# EAGLE design ssrv1 (EAGLE 5.06)

## Sheet 1 of 2
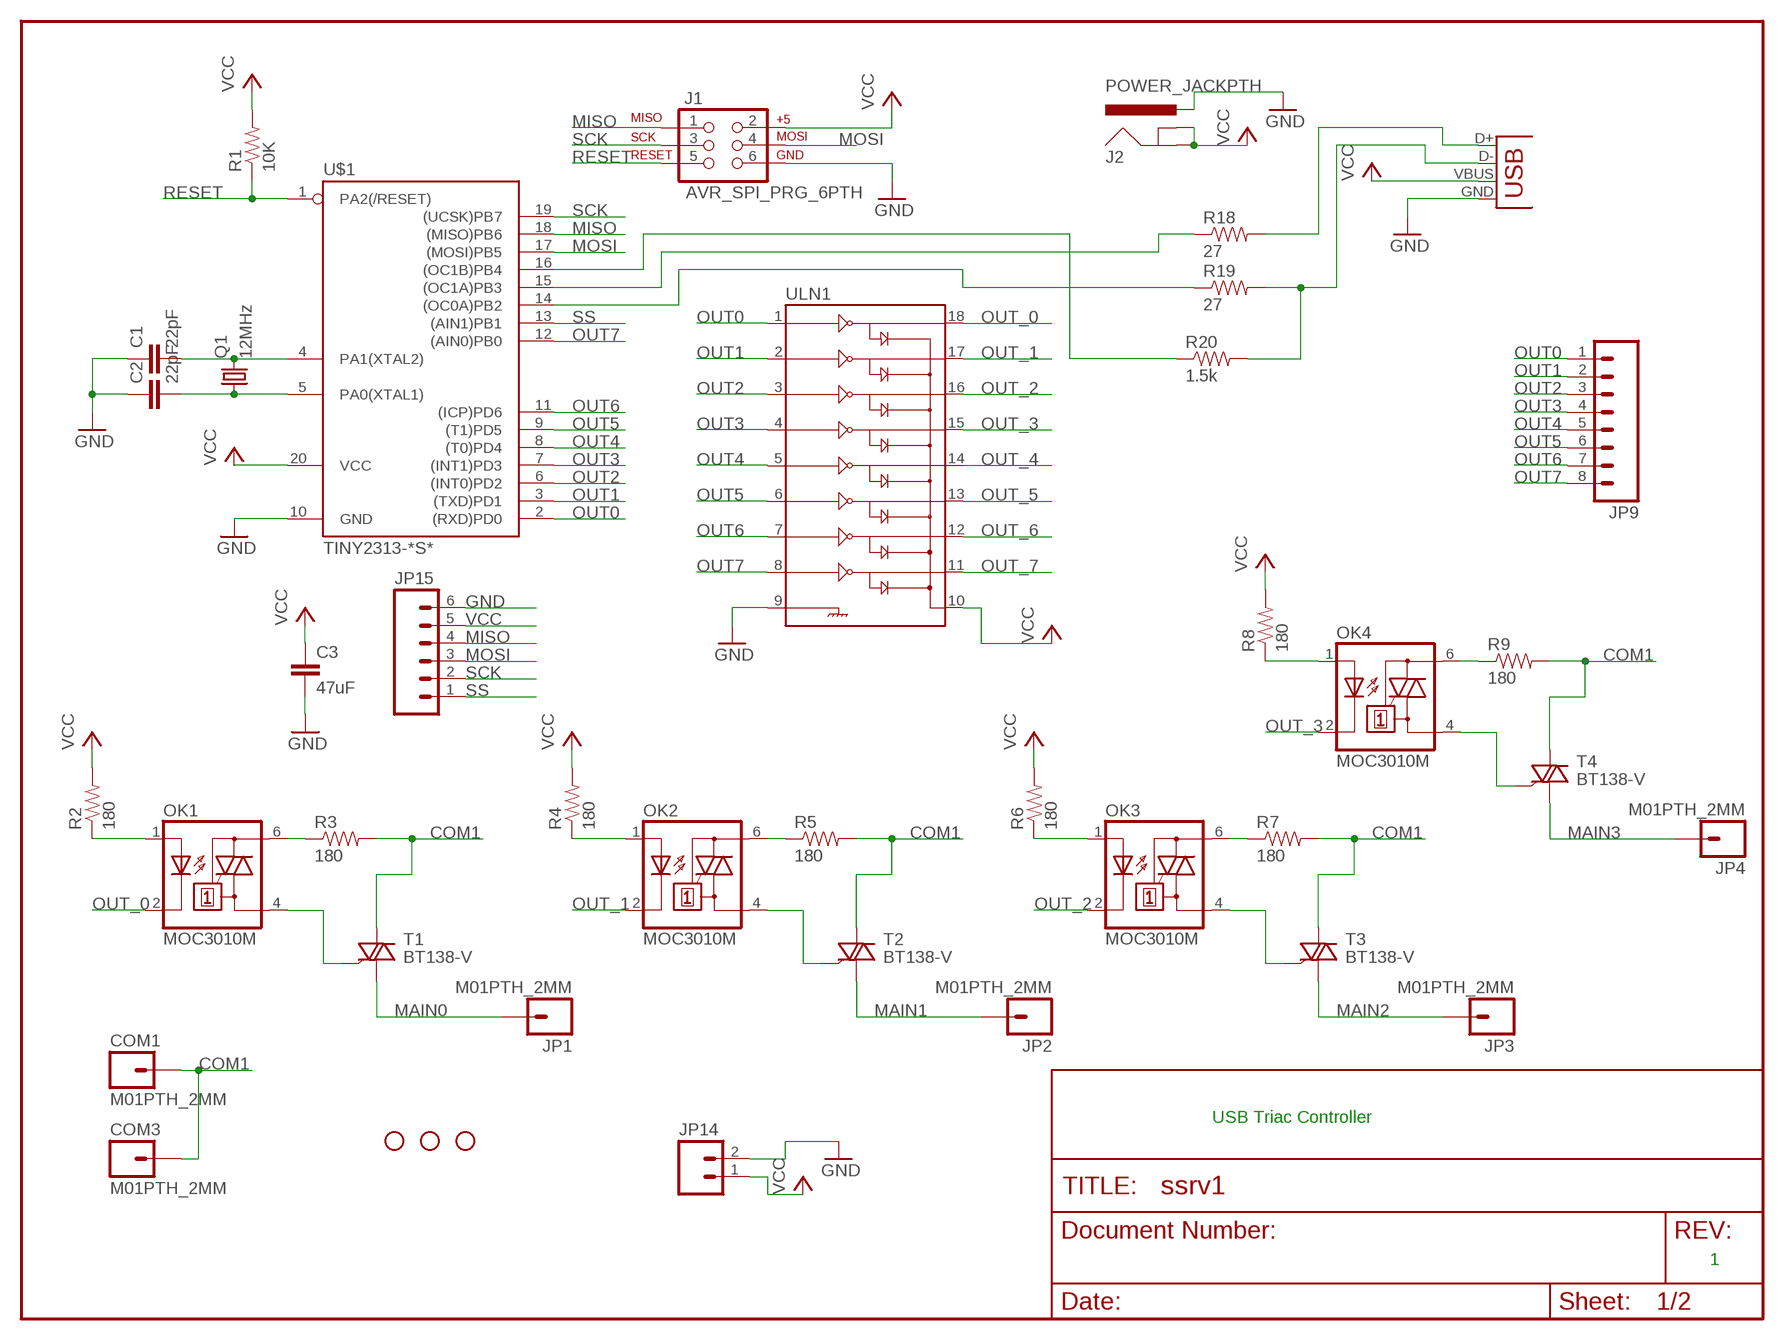
[diagram p0: schematic, sheet 1]

### Parts
C1  22pF  CAP0402-CAP  [0402-CAP]
C2  22pF  CAP0402-CAP  [0402-CAP]
C3  47uF  CAP1210  [1210]
COM1  M01PTH_2MM  [1X01_2MM]
COM3  M01PTH_2MM  [1X01_2MM]
J1  AVR_SPI_PRG_6PTH  [2X3]
J2  POWER_JACKPTH  [POWER_JACK_PTH]
JP1  M01PTH_2MM  [1X01_2MM]
JP2  M01PTH_2MM  [1X01_2MM]
JP3  M01PTH_2MM  [1X01_2MM]
JP4  M01PTH_2MM  [1X01_2MM]
JP9  M08  [1X08]
JP10  STAND-OFF  [STAND-OFF]
JP11  STAND-OFF  [STAND-OFF]
JP12  STAND-OFF  [STAND-OFF]
JP14  M02  [1X02_LONGPADS]
JP15  M06SIP  [1X06]
OK1  MOC3010M  [DIL06]
OK2  MOC3010M  [DIL06]
OK3  MOC3010M  [DIL06]
OK4  MOC3010M  [DIL06]
Q1  12MHz  CRYSTALTC38H  [TC38H]
R1  10K  RESISTOR0402-RES  [0402-RES]
R2  180  RESISTOR0402-RES  [0402-RES]
R3  180  RESISTORPTH1  [AXIAL-0.3]
R4  180  RESISTOR0402-RES  [0402-RES]
R5  180  RESISTORPTH1  [AXIAL-0.3]
R6  180  RESISTOR0402-RES  [0402-RES]
R7  180  RESISTORPTH1  [AXIAL-0.3]
R8  180  RESISTOR0402-RES  [0402-RES]
R9  180  RESISTORPTH1  [AXIAL-0.3]
R18  27  RESISTOR0402-RES  [0402-RES]
R19  27  RESISTOR0402-RES  [0402-RES]
R20  1.5k  RESISTOR0402-RES  [0402-RES]
T1  BT138-V  [TO220BV]
T2  BT138-V  [TO220BV]
T3  BT138-V  [TO220BV]
T4  BT138-V  [TO220BV]
U$1  TINY2313-*S*  [SO20L$]
ULN1  ULN2803SOICW  [SO18L]
X1  USBSMD  [USB-MINIB]

### Nets
COM1 [AC]: COM1.1 COM3.1 R3.P$2 R5.P$2 R7.P$2 R9.P$2 T1.T2(A2) T2.T2(A2) T3.T2(A2) T4.T2(A2)
GND: C1.1 C2.1 C3.2 J1.6 J2.PWR JP14.2 JP15.6 U$1.10(GND) ULN1.9 X1.GND
MAIN0 [AC]: JP1.1 T1.T1(A1)
MAIN1 [AC]: JP2.1 T2.T1(A1)
MAIN2 [AC]: JP3.1 T3.T1(A1)
MAIN3 [AC]: JP4.1 T4.T1(A1)
MISO: J1.1 JP15.4 U$1.18((MISO)PB6)
MOSI: J1.4 JP15.3 U$1.17((MOSI)PB5)
N$1: C2.2 Q1.1 U$1.5(PA0(XTAL1))
N$2: OK1.6(A2) R3.P$1
N$3: OK1.1(A) R2.1
N$4: C1.2 Q1.2 U$1.4(PA1(XTAL2))
N$5: OK2.4(A1) T2.G
N$6: OK1.4(A1) T1.G
N$7: OK2.6(A2) R5.P$1
N$8: OK2.1(A) R4.1
N$9: OK3.4(A1) T3.G
N$10: OK3.6(A2) R7.P$1
N$11: OK3.1(A) R6.1
N$12: OK4.4(A1) T4.G
N$13: OK4.6(A2) R9.P$1
N$14: OK4.1(A) R8.1
N$27: R19.2 R20.2 X1.D-
N$28: R19.1 U$1.14((OC0A)PB2)
N$29: R18.2 X1.D+
N$30: R18.1 U$1.15((OC1A)PB3)
N$31: R20.1 U$1.16((OC1B)PB4)
OUT0: JP9.1 U$1.2((RXD)PD0) ULN1.1
OUT1: JP9.2 U$1.3((TXD)PD1) ULN1.2
OUT2: JP9.3 U$1.6((INT0)PD2) ULN1.3
OUT3: JP9.4 U$1.7((INT1)PD3) ULN1.4
OUT4: JP9.5 U$1.8((T0)PD4) ULN1.5
OUT5: JP9.6 U$1.9((T1)PD5) ULN1.6
OUT6: JP9.7 U$1.11((ICP)PD6) ULN1.7
OUT7: JP9.8 U$1.12((AIN0)PB0) ULN1.8
OUT_0: OK1.2(C) ULN1.18
OUT_1: OK2.2(C) ULN1.17
OUT_2: OK3.2(C) ULN1.16
OUT_3: OK4.2(C) ULN1.15
OUT_4: ULN1.14 ; also sheet 2
OUT_5: ULN1.13 ; also sheet 2
OUT_6: ULN1.12 ; also sheet 2
OUT_7: ULN1.11 ; also sheet 2
RESET: J1.5 R1.1 U$1.1(PA2(/RESET))
SCK: J1.3 JP15.2 U$1.19((UCSK)PB7)
SS: JP15.1 U$1.13((AIN1)PB1)
VCC: C3.1 J1.2 J2.GND J2.GNDBREAK JP14.1 JP15.5 R1.2 R2.2 R4.2 R6.2 R8.2 U$1.20(VCC) ULN1.10 X1.VBUS ; also sheet 2

### Notes on the sheet
- USB Triac Controller
- 1

## Sheet 2 of 2
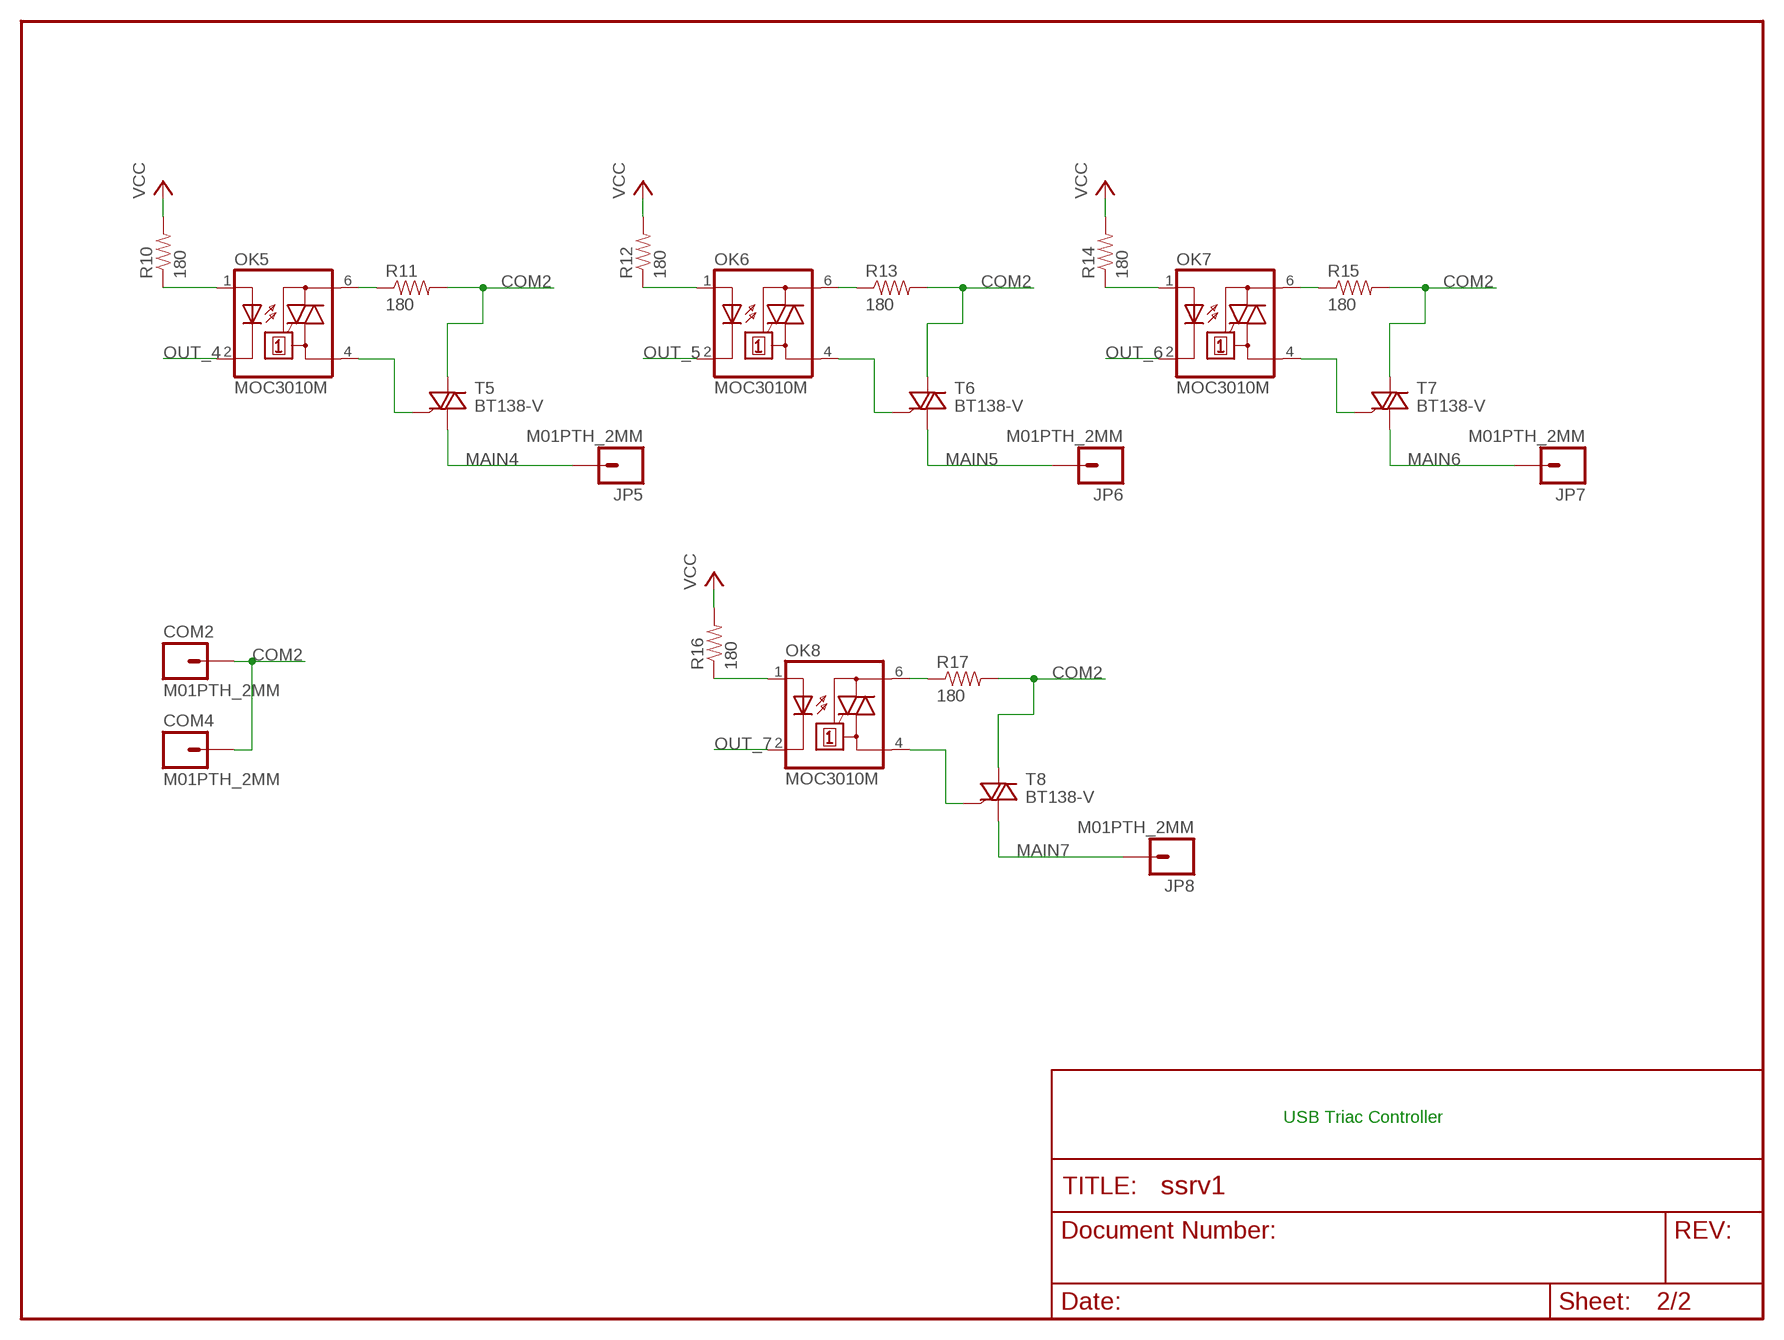
[diagram p1: schematic, sheet 2]

### Parts
COM2  M01PTH_2MM  [1X01_2MM]
COM4  M01PTH_2MM  [1X01_2MM]
JP5  M01PTH_2MM  [1X01_2MM]
JP6  M01PTH_2MM  [1X01_2MM]
JP7  M01PTH_2MM  [1X01_2MM]
JP8  M01PTH_2MM  [1X01_2MM]
OK5  MOC3010M  [DIL06]
OK6  MOC3010M  [DIL06]
OK7  MOC3010M  [DIL06]
OK8  MOC3010M  [DIL06]
R10  180  RESISTOR0402-RES  [0402-RES]
R11  180  RESISTORPTH1  [AXIAL-0.3]
R12  180  RESISTOR0402-RES  [0402-RES]
R13  180  RESISTORPTH1  [AXIAL-0.3]
R14  180  RESISTOR0402-RES  [0402-RES]
R15  180  RESISTORPTH1  [AXIAL-0.3]
R16  180  RESISTOR0402-RES  [0402-RES]
R17  180  RESISTORPTH1  [AXIAL-0.3]
T5  BT138-V  [TO220BV]
T6  BT138-V  [TO220BV]
T7  BT138-V  [TO220BV]
T8  BT138-V  [TO220BV]

### Nets
COM2 [AC]: COM2.1 COM4.1 R11.P$2 R13.P$2 R15.P$2 R17.P$2 T5.T2(A2) T6.T2(A2) T7.T2(A2) T8.T2(A2)
MAIN4 [AC]: JP5.1 T5.T1(A1)
MAIN5 [AC]: JP6.1 T6.T1(A1)
MAIN6 [AC]: JP7.1 T7.T1(A1)
MAIN7 [AC]: JP8.1 T8.T1(A1)
N$15: OK5.4(A1) T5.G
N$16: OK5.6(A2) R11.P$1
N$17: OK5.1(A) R10.1
N$18: OK6.4(A1) T6.G
N$19: OK6.6(A2) R13.P$1
N$20: OK6.1(A) R12.1
N$21: OK7.4(A1) T7.G
N$22: OK7.6(A2) R15.P$1
N$23: OK7.1(A) R14.1
N$24: OK8.4(A1) T8.G
N$25: OK8.6(A2) R17.P$1
N$26: OK8.1(A) R16.1
OUT_4: OK5.2(C) ; also sheet 1
OUT_5: OK6.2(C) ; also sheet 1
OUT_6: OK7.2(C) ; also sheet 1
OUT_7: OK8.2(C) ; also sheet 1
VCC: R10.2 R12.2 R14.2 R16.2 ; also sheet 1

### Notes on the sheet
- USB Triac Controller

## Library data of the parts
C1-C3 = SparkFun:CAP: Capacitor Standard 0603 ceramic capacitor, and 0.1" leaded capacitor.
COM1-COM4 JP1-JP8 = SparkFun:M01: Header 1 Standard 1-pin 0.1" header. Use with straight break away headers (SKU : PRT-00116), right angle break away headers (PRT-00553), swiss pins (PRT-00743), machine pins (PRT-00117), and female headers (PRT-00115).
J1 = SparkFun:AVR_SPI_PRG_6: AVR ISP 6 Pin This is the reduced ISP connector for AVR programming. Common on Arduino. This footprint will take up less PCB space and can be used with a 10-pin to 6-pin adapter such as SKU: BOB-08508
J2 = SparkFun:POWER_JACK: Power Jack This is the standard 5.5mm barrel jack for power. The PTH is the most common, proven, reliable, footprint. All others are experimental. The Slot footprint only works if the mill layer is transmitted to the PCB fab house so be warned. Spark Fun Electronics SKU : PRT-00119. Mating wall wart : TOL-00298 (and others)
JP9 = SparkFun:M08: Header 8 Standard 8-pin 0.1" header. Use with straight break away headers (SKU : PRT-00116), right angle break away headers (PRT-00553), swiss pins (PRT-00743), machine pins (PRT-00117), and female headers (PRT-00115).
JP10-JP12 = SparkFun:STAND-OFF: Stand Off This is the mechanical footprint for a #4 phillips button head screw. Use the keepout ring to avoid running the screw head into surrounding components. SKU : PRT-00447
JP14 = SparkFun:M02: Header 2 Standard 2-pin 0.1" header. Use with straight break away headers (SKU : PRT-00116), right angle break away headers (PRT-00553), swiss pins (PRT-00743), machine pins (PRT-00117), and female headers (PRT-00115). Molex polarized connector foot print use with SKU : PRT-08233 with associated crimp pins and housings.
JP15 = SparkFun:M06: Header 6 Standard 6-pin 0.1" header. Use with straight break away headers (SKU : PRT-00116), right angle break away headers (PRT-00553), swiss pins (PRT-00743), machine pins (PRT-00117), and female headers (PRT-00115). Molex polarized connector foot print use with SKU : PRT-08094 with associated crimp pins and housings. NOTES ON THE VARIANTS LOCK and LOCK_LONGPADS... This footprint was designed to help hold the alignment of a through-hole component (i.e. 6-pin header) while soldering it into place. You may notice that each hole has been shifted either up or down by 0.005 of an inch from it's more standard position (which is a perfectly straight line). This slight alteration caused the pins (the squares in the middle) to touch the edges of the holes. Because they are alternating, it causes a "brace" to hold the component in place. 0.005 has proven to be the perfect amount of "off-center" position when using our standard breakaway headers. Although looks a little odd when you look at the bare footprint, once you have a header in there, the alteration is very hard to notice. Also, if you push a header all the way into place, it is covered up entirely on the bottom side. This idea of altering the position of holes to aid alignment will be further integrated into the Sparkfun Library for other footprints. It can help hold any component with 3 or more connection pins.
OK1-OK8 = optocoupler:MOC30*M: RANDOM-PHASE OPTOISOLATORS TRIAC DRIVER OUTPUT Source: http://www.fairchildsemi.com MOC3020-M.pdf
Q1 = SparkFun:CRYSTAL: Crystals Various standard crystals. Proven footprints. Spark Fun Electronics SKU : COM-00534
R1-R20 = SparkFun:RESISTOR: Resistor Basic schematic elements and footprints for 0603, 1206, and PTH 1/10th watt (small) resistors.
T1-T8 = triac:BT138: TRIAC Source: http://www.semiconductors.philips.com BT138_SERIES_2.pdf
U$1 = avr-6:TINY2313*: Atmel Tiny2313 2K Flash, 128 bytes EEPROM, 128 bytes RAM
ULN1 = SparkFun:ULN2803: Darlington Driver ULN2803 Darlington array. 500mA max per channel, 8-channel package. Spark Fun Electronics SKU : COM-00312
X1 = SparkFun:USB: USB Connectors USB-B-PTH is fully proven SKU : PRT-00139 USB-miniB is fully proven SKU : PRT-00587 USB-A-PCB is untested. USB-A-H is throughly reviewed, but untested. Spark Fun Electronics SKU : PRT-00437 USB-B-SMT is throughly reviewed, but untested. Needs silkscreen touching up. USB-A-S has not been used/tested USB-MB-H has not been used/tested

## Net classes
1 AC: width 1.524 mm, clearance 1.016 mm

## Board
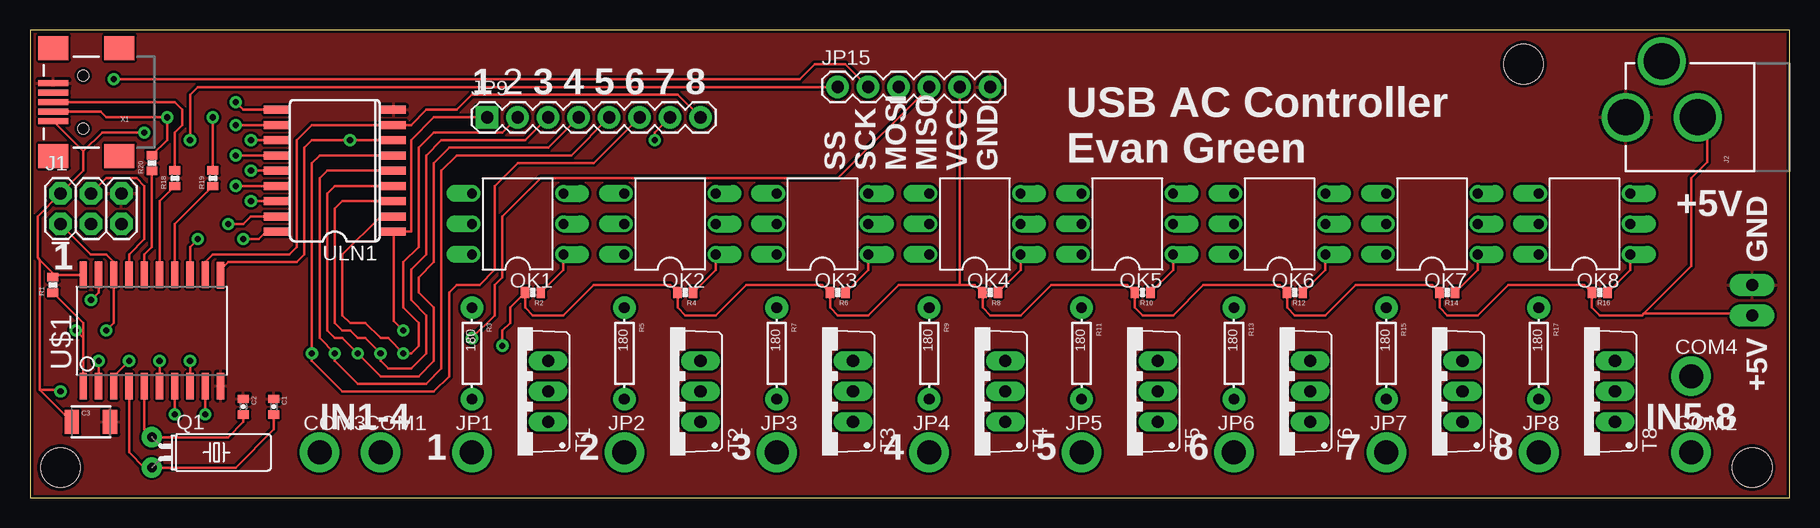
[diagram p2: board, top side]
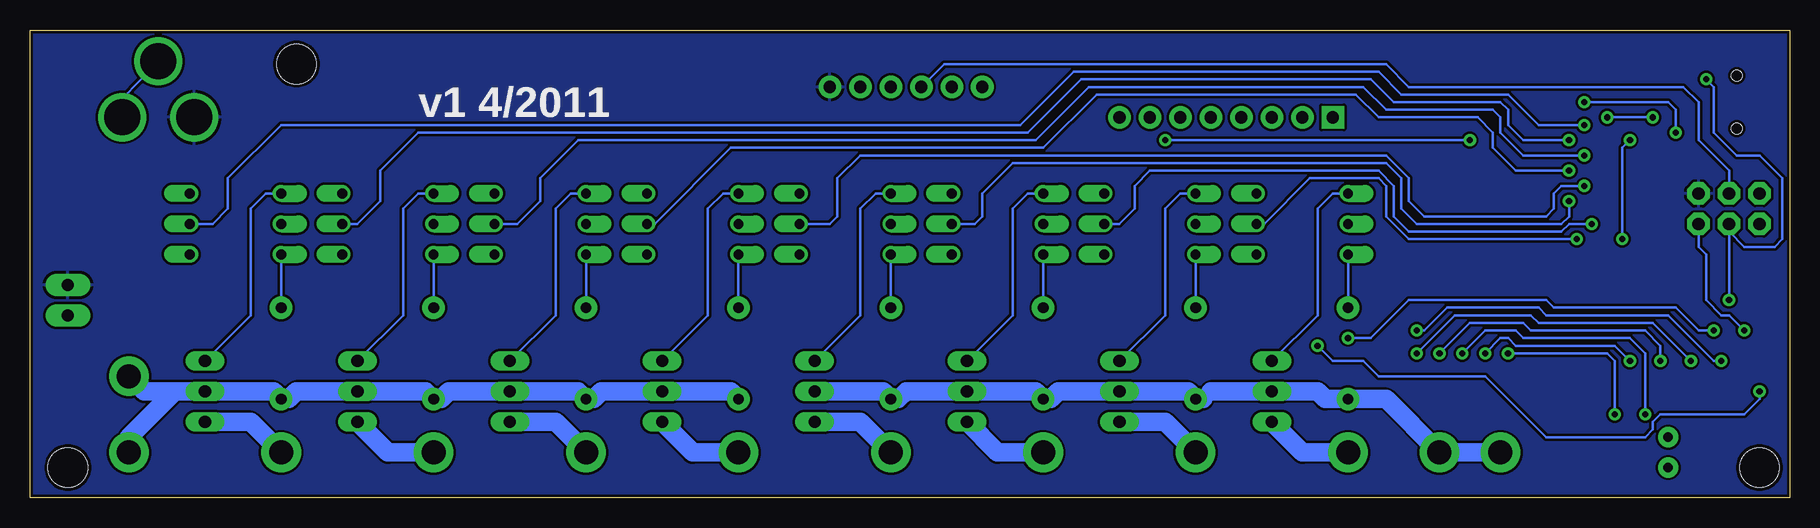
[diagram p3: board, bottom side, seen from below]

Size 146.66 x 39.04 mm. Coordinates in mm from the lower left corner, seen from the top.
Outline: 0,0 146.66,0 146.66,39.04 0,39.04 0,0
Copper layers (1*16): Top 0.035mm / dielectric 1.5mm / Bottom 0.035mm
Design rules "SparkFun": minimum track width 8mil, minimum drill 20mil, track to track 8mil, track to pad 8mil, pad to pad 8mil, via to via 8mil, smd to smd 8mil, copper to edge 10mil, drill to drill 8mil, minimum pad ring 12mil, minimum via ring 10mil, stop-mask expansion 4mil, vias tented up to drill 25mil, thermal gap 10mil

### Footprints (pad centres in the part's own frame; a part is rotated, then mirrored left to right if it is on the bottom)
0402-CAP = smd 0.7 x 0.9: 1 -0.65,0; 2 0.65,0
1210 = smd 1.2 x 2: 1 -1.6,0; 2 1.6,0
1X01_2MM = drill 2 pad 3.302 round: 1 0,0
2X3 = drill 1.016 pad 1.88 octagon: 1 0,0; 2 0,2.54; 3 2.54,0; 4 2.54,2.54; 5 5.08,0; 6 5.08,2.54
POWER_JACK_PTH = drill 2.997 round: GND 0,7.7; GNDBREAK 4.7,10.7; PWR 0,13.7
1X08 = drill 1.016 pad 1.88 square: 1 0,0 | drill 1.016 pad 1.88 round: 2 2.54,0; 3 5.08,0; 4 7.62,0; 5 10.16,0; 6 12.7,0; 7 15.24,0; 8 17.78,0
STAND-OFF = hole 3.302: 0,0
1X02_LONGPADS = drill 1.016 pad 1.88 long: 1 0,0; 2 2.54,0
1X06 = drill 1.016 pad 1.88 round: 1 0,0; 2 2.54,0; 3 5.08,0; 4 7.62,0; 5 10.16,0; 6 12.7,0
DIL06 = drill 0.813 offset: 1 -2.54,-3.81; 2 0,-3.81; 3 2.54,-3.81; 4 2.54,3.81; 5 0,3.81; 6 -2.54,3.81
TC38H = drill 0.813 pad 1.676 round: 1 -1.27,0; 2 1.27,0
0402-RES = smd 0.7 x 0.9: 1 -0.65,0; 2 0.65,0
AXIAL-0.3 = drill 0.9 pad 1.88 round: P$1 -3.81,0; P$2 3.81,0
TO220BV = drill 1.016 long: G 2.54,-2.54; T1 -2.54,-2.54; T2 0,-2.54
SO20L$ = smd 0.61 x 2.21: 1 -5.715,-4.636; 2 -4.445,-4.636; 3 -3.175,-4.636; 4 -1.905,-4.636; 5 -0.635,-4.636; 6 0.635,-4.636; 7 1.905,-4.636; 8 3.175,-4.636; 9 4.445,-4.636; 10 5.715,-4.636; 11 5.715,4.61; 12 4.445,4.636; 13 3.175,4.636; 14 1.905,4.636; 15 0.635,4.636; 16 -0.635,4.636; 17 -1.905,4.636; 18 -3.175,4.636; 19 -4.445,4.636; 20 -5.715,4.636
SO18L = smd 0.66 x 2.032: 1 -0.635,-4.902; 2 0.635,-4.902; 3 1.905,-4.902; 4 3.175,-4.902; 5 4.445,-4.902; 6 5.715,-4.902; 7 6.985,-4.902; 8 8.255,-4.902; 9 9.525,-4.902; 10 9.525,4.902; 11 8.255,4.902; 12 6.985,4.902; 13 5.715,4.902; 14 4.445,4.902; 15 3.175,4.902; 16 1.905,4.902; 17 0.635,4.902; 18 -0.635,4.902
USB-MINIB = smd 2.5 x 0.5: D+ 2.5,0; D- 2.5,0.8; GND 2.5,-1.6; ID 2.5,-0.8; VBUS 2.5,1.6 | smd 2.5 x 2: GND@1 -3,-4.5; GND@2 -3,4.5; GND@3 2.5,4.5; GND@4 2.5,-4.5 | hole 0.9: 0,2.2; 0,-2.2

### Placement (x,y rotation side)
C1  20.32,7.62 270 top
C2  17.78,7.62 270 top
C3  5.08,6.35 0 top
COM1  29.21,3.81 0 top
COM2  138.43,3.81 0 top
COM3  24.13,3.81 0 top
COM4  138.43,10.16 0 top
J1  2.54,22.86 0 top
J2  146.69,31.75 90 top
JP1  36.83,3.81 0 top
JP2  49.53,3.81 0 top
JP3  62.23,3.81 0 top
JP4  74.93,3.81 0 top
JP5  87.63,3.81 0 top
JP6  100.33,3.81 0 top
JP7  113.03,3.81 0 top
JP8  125.73,3.81 0 top
JP9  38.1,31.75 0 top
JP10  2.54,2.54 0 top
JP11  143.51,2.54 0 top
JP12  124.46,36.2 0 top
JP14  143.51,15.24 90 top
JP15  67.31,34.29 0 top
OK1  40.64,22.86 90 top
OK2  53.34,22.86 90 top
OK3  66.04,22.86 90 top
OK4  78.74,22.86 90 top
OK5  91.44,22.86 90 top
OK6  104.14,22.86 90 top
OK7  116.84,22.86 90 top
OK8  129.54,22.86 90 top
Q1  10.16,3.81 270 top
R1  1.91,17.78 90 top
R2  41.91,17.14 180 top
R3  36.83,12.06 270 top
R4  54.61,17.14 180 top
R5  49.53,12.06 270 top
R6  67.31,17.14 180 top
R7  62.23,12.06 270 top
R8  80.01,17.14 180 top
R9  74.93,12.06 270 top
R10  92.71,17.14 180 top
R11  87.63,12.06 270 top
R12  105.41,17.14 180 top
R13  100.33,12.06 270 top
R14  118.11,17.14 180 top
R15  113.03,12.06 270 top
R16  130.81,17.14 180 top
R17  125.73,12.06 270 top
R18  12.06,26.67 90 top
R19  15.24,26.67 90 top
R20  10.16,27.94 90 top
T1  40.64,8.89 90 top
T2  53.34,8.89 90 top
T3  66.04,8.89 90 top
T4  78.74,8.89 90 top
T5  91.44,8.89 90 top
T6  104.14,8.89 90 top
T7  116.84,8.89 90 top
T8  129.54,8.89 90 top
U$1  10.16,13.97 0 top
ULN1  25.4,22.86 90 top
X1  4.45,33.02 180 top

### Tracks (layer width: path | path; a pad name or v marks a point on that pad's centre or on a via)
COM1
  Bottom 1.016: 48.26,8.89 48.9,8.26 | 61.59,8.26 R7.P$2
  Bottom 1.524: 48.26,8.89 T1.T2 39.37,8.89 38.73,8.26 R3.P$2 33.66,8.26 COM1.1 COM3.1 | 48.9,8.26 R5.P$2 50.16,8.89 T2.T2 60.96,8.89 61.59,8.26 | R7.P$2 62.87,8.89 T3.T2 73.66,8.89 74.3,8.26 R9.P$2 75.56,8.89 T4.T2
COM2
  Bottom 1.016: 88.27,8.89 T5.T2 | 125.09,8.26 R17.P$2
  Bottom 1.524: R11.P$2 88.27,8.89 99.06,8.89 99.69,8.26 R13.P$2 100.97,8.89 T6.T2 111.76,8.89 112.39,8.26 R15.P$2 113.67,8.89 T7.T2 124.46,8.89 125.09,8.26 | R17.P$2 126.36,8.89 T8.T2 134.62,8.89 | 134.62,8.89 138.43,5.08 COM2.1 | COM4.1 137.16,8.89 134.62,8.89
GND
  pour Top: 0,0 146.69,0 146.69,38.73 0,38.73
  pour Bottom: 0,0 146.69,0 146.69,38.73 0,38.73
MAIN0
  Bottom 1.524: T1.T1 40.64,3.81 JP1.1
MAIN1
  Bottom 1.524: JP2.1 52.07,6.35 T2.T1
MAIN2
  Bottom 1.524: T3.T1 66.04,3.81 JP3.1
MAIN3
  Bottom 1.524: JP4.1 77.47,6.35 T4.T1
MAIN4
  Bottom 1.524: JP5.1 91.44,3.81 T5.T1
MAIN5
  Bottom 1.524: JP6.1 102.87,6.35 T6.T1
MAIN6
  Bottom 1.524: JP7.1 116.84,3.81 T7.T1
MAIN7
  Bottom 1.524: JP8.1 128.27,6.35 T8.T1
MISO  (via drill 0.51)
  Top 0.203: J1.1 5.08,20.32 6.35,20.32 6.99,19.68 U$1.18 6.99,14.61 v6.35,13.97 | JP15.4 67.31,26.67 42.55,26.67 39.37,23.5 39.37,18.41 38.73,17.78 38.73,15.24 v36.83,13.34
  Bottom 0.203: v6.35,13.97 7.62,13.97 9.53,15.88 19.68,15.88 20.32,16.51 31.75,16.51 34.92,13.34 v36.83,13.34
MOSI
  Top 0.203: J1.4 6.35,26.67 8.89,26.67 9.53,26.04 9.53,21.59 8.26,20.32 U$1.17
  Bottom 0.203: JP15.3 70.48,36.2 33.66,36.2 31.75,34.29 8.89,34.29 7.62,33.02 7.62,29.84 5.08,27.3 J1.4
N$1
  Top 0.203: U$1.5 9.53,5.71 Q1.1 16.51,5.08 17.78,6.35 C2.2
N$2
  Bottom 0.203: R3.P$1 OK1.6
N$3
  Top 0.203: R2.1 44.45,19.04 OK1.1
N$4
  Top 0.203: U$1.4 8.26,3.81 9.53,2.54 Q1.2 17.14,2.54 20.32,5.71 C1.2
N$5
  Bottom 0.203: T2.G 52.07,15.24 52.07,24.13 50.8,25.4 OK2.4
N$6
  Bottom 0.203: T1.G 39.37,15.24 39.37,24.13 38.1,25.4 OK1.4
N$7
  Bottom 0.203: R5.P$1 OK2.6
N$8
  Top 0.203: R4.1 57.15,19.04 OK2.1
N$9
  Bottom 0.203: T3.G 64.77,15.24 64.77,24.13 63.5,25.4 OK3.4
N$10
  Bottom 0.203: R7.P$1 OK3.6
N$11
  Top 0.203: R6.1 69.85,19.04 OK3.1
N$12
  Bottom 0.203: T4.G 77.47,15.24 77.47,24.13 76.2,25.4 OK4.4
N$13
  Bottom 0.203: R9.P$1 OK4.6
N$14
  Top 0.203: R8.1 82.55,19.04 OK4.1
N$15
  Bottom 0.203: T5.G 90.17,15.24 90.17,24.13 88.9,25.4 OK5.4
N$16
  Bottom 0.203: R11.P$1 OK5.6
N$17
  Top 0.203: R10.1 95.25,19.04 OK5.1
N$18
  Bottom 0.203: T6.G 102.87,15.24 102.87,24.13 101.6,25.4 OK6.4
N$19
  Bottom 0.203: R13.P$1 OK6.6
N$20
  Top 0.203: R12.1 107.95,19.04 OK6.1
N$21
  Bottom 0.203: T7.G 115.57,15.24 115.57,24.13 114.3,25.4 OK7.4
N$22
  Bottom 0.203: R15.P$1 OK7.6
N$23
  Top 0.203: R14.1 120.65,19.04 OK7.1
N$24
  Bottom 0.203: T8.G 128.27,15.24 128.27,24.13 127,25.4 OK8.4
N$25
  Bottom 0.203: R17.P$1 OK8.6
N$26
  Top 0.203: R16.1 133.35,19.04 OK8.1
N$27  (via drill 0.51)
  Top 0.203: v15.24,31.75 R19.2 | X1.D- 5.88,32.22 6.35,31.75 v11.43,31.75 11.43,29.86 R20.2
  Bottom 0.203: v11.43,31.75 v15.24,31.75
N$28
  Top 0.203: U$1.14 12.06,22.86 15.22,26.02 R19.1
N$29
  Top 0.203: X1.D+ 12.06,33.02 12.7,32.38 12.7,31.11 12.06,30.48 R18.2
N$30
  Top 0.203: U$1.15 10.79,24.77 R18.1
N$31
  Top 0.203: U$1.16 9.53,20.32 10.16,20.95 R20.1
OUT0  (via drill 0.51)
  Top 0.203: U$1.2 v5.71,11.43 | v31.11,13.97 30.3,14.78 ULN1.1 31.75,22.23 31.75,29.84 33.66,31.75 JP9.1
  Bottom 0.203: v5.71,11.43 6.35,11.43 10.16,15.24 20.32,15.24 20.95,15.88 28.57,15.88 30.48,13.97 v31.11,13.97
OUT1  (via drill 0.51)
  Top 0.203: ULN1.2 29.21,23.5 26.04,20.32 26.04,15.24 26.67,14.61 27.94,14.61 29.21,13.34 29.84,13.34 v31.11,12.06 31.75,12.06 32.38,12.7 32.38,14.61 31.11,15.88 31.11,19.68 32.38,20.95 32.38,29.21 33.66,30.48 39.37,30.48 JP9.2 | v8.26,11.43 6.99,10.16 U$1.3
  Bottom 0.203: v31.11,12.06 27.94,15.24 21.59,15.24 20.95,14.61 11.43,14.61 v8.26,11.43
OUT2  (via drill 0.51)
  Top 0.203: ULN1.3 26.04,24.77 25.4,24.13 25.4,14.61 26.04,13.97 26.67,13.97 27.3,13.34 27.94,13.34 v29.21,12.06 29.21,11.43 29.84,10.79 31.75,10.79 33.02,12.06 33.02,15.24 31.75,16.51 31.75,19.05 33.02,20.32 33.02,28.57 34.29,29.84 41.27,29.84 JP9.3 | U$1.6 v10.79,11.43
  Bottom 0.203: v29.21,12.06 26.67,14.61 22.23,14.61 21.59,13.97 12.06,13.97 10.79,12.7 v10.79,11.43
OUT3  (via drill 0.51)
  Top 0.203: ULN1.4 25.4,26.04 24.77,25.4 24.77,13.97 25.4,13.34 26.04,13.34 v27.3,12.06 29.21,10.16 32.38,10.16 33.66,11.43 33.66,15.88 32.38,17.14 32.38,18.41 33.66,19.68 33.66,27.94 34.92,29.21 43.18,29.21 JP9.4 | v12.06,6.99 U$1.7
  Bottom 0.203: v27.3,12.06 25.4,13.97 22.86,13.97 22.23,13.34 13.34,13.34 12.06,12.06 v12.06,6.99
OUT4  (via drill 0.51)
  Top 0.203: U$1.8 v13.34,11.43 | ULN1.5 24.77,27.3 24.13,26.67 24.13,13.34 v25.4,12.06 25.4,11.43 27.3,9.53 33.02,9.53 34.29,10.79 34.29,27.3 35.56,28.57 45.09,28.57 JP9.5
  Bottom 0.203: v25.4,12.06 24.13,13.34 23.5,13.34 22.86,12.7 14.61,12.7 v13.34,11.43
OUT5  (via drill 0.51)
  Top 0.203: ULN1.6 24.13,28.57 23.5,27.94 v23.5,12.06 23.5,11.43 26.04,8.89 33.66,8.89 34.92,10.16 34.92,17.14 35.56,17.78 37.47,17.78 38.73,19.05 38.73,26.04 40.64,27.94 46.99,27.94 JP9.6 | v14.61,6.99 U$1.9
  Bottom 0.203: v23.5,12.06 15.24,12.06 14.61,11.43 v14.61,6.99
OUT6  (via drill 0.51)
  Top 0.203: ULN1.7 27.94,29.84 v26.67,29.84 23.5,29.84 22.86,29.21 22.86,20.32 22.23,19.68 16.51,19.68 15.88,19.05 U$1.11 | JP9.7 52.07,30.48 v52.07,29.84
  Bottom 0.203: v26.67,29.84 v52.07,29.84
OUT7
  Top 0.203: U$1.12 14.61,19.68 15.24,20.32 21.59,20.32 22.23,20.95 22.23,29.84 23.5,31.11 ULN1.8 31.75,31.11 33.02,32.38 35.56,32.38 36.83,33.66 53.98,33.66 JP9.8
OUT_0  (via drill 0.51)
  Top 0.203: ULN1.18 19.68,22.23 19.05,21.59 v17.78,21.59
  Bottom 0.203: v17.78,21.59 31.75,21.59 33.66,23.5 33.66,26.04 34.29,26.67 40.01,26.67 43.81,22.86 OK1.2
OUT_1  (via drill 0.51)
  Top 0.203: ULN1.17 18.41,23.5 17.78,22.86 v16.51,22.86
  Bottom 0.203: v16.51,22.86 18.41,22.86 19.05,22.23 31.75,22.23 33.02,23.5 33.02,26.04 34.29,27.3 53.34,27.3 54.61,26.04 54.61,24.13 55.88,22.86 OK2.2
OUT_2  (via drill 0.51)
  Top 0.203: v18.41,24.77 ULN1.16
  Bottom 0.203: v18.41,24.77 18.41,23.5 19.05,22.86 31.11,22.86 32.38,24.13 32.38,26.67 33.66,27.94 64.77,27.94 67.31,25.4 67.31,23.5 67.94,22.86 OK3.2
OUT_3  (via drill 0.51)
  Top 0.203: v17.14,26.04 ULN1.15
  Bottom 0.203: v17.14,26.04 19.05,26.04 19.68,25.4 19.68,24.13 20.32,23.5 30.48,23.5 31.75,24.77 31.75,26.67 33.66,28.57 77.47,28.57 79.38,26.67 79.38,23.5 80.01,22.86 OK4.2
OUT_4  (via drill 0.51)
  Top 0.203: v18.41,27.3 ULN1.14
  Bottom 0.203: v18.41,27.3 22.86,27.3 24.77,29.21 24.77,30.48 26.04,31.75 34.29,31.75 36.2,33.66 57.78,33.66 62.23,29.21 88.27,29.21 94.61,22.86 OK5.2
OUT_5  (via drill 0.51)
  Top 0.203: v17.14,28.57 ULN1.13
  Bottom 0.203: v17.14,28.57 22.23,28.57 24.13,30.48 24.13,31.75 24.77,32.38 33.66,32.38 35.56,34.29 58.42,34.29 62.87,29.84 100.97,29.84 104.14,26.67 104.14,24.77 106.05,22.86 OK6.2
OUT_6  (via drill 0.51)
  Top 0.203: v18.41,29.84 ULN1.12
  Bottom 0.203: v18.41,29.84 22.23,29.84 23.5,31.11 23.5,32.38 24.13,33.02 33.02,33.02 34.92,34.92 59.05,34.92 63.5,30.48 114.3,30.48 117.47,27.3 117.47,24.77 119.38,22.86 OK7.2
OUT_7  (via drill 0.51)
  Top 0.203: v17.14,31.11 ULN1.11
  Bottom 0.203: v17.14,31.11 20.95,31.11 23.5,33.66 32.38,33.66 34.29,35.56 59.69,35.56 64.14,31.11 125.73,31.11 130.18,26.67 130.18,24.13 131.44,22.86 OK8.2
RESET  (via drill 0.51)
  Top 0.203: 4.45,13.34 v3.81,13.97 | U$1.1 4.45,13.34 | R1.1 4.45,14.59 4.45,13.34
  Bottom 0.203: v3.81,13.97 5.08,15.24 5.71,15.24 6.99,16.51 6.99,20.32 7.62,20.95 J1.5
SCK  (via drill 0.51)
  Top 0.203: v5.08,16.51 5.71,17.14 U$1.19 | JP15.2 67.94,36.2 65.41,36.2 64.14,34.92 v6.99,34.92
  Bottom 0.203: v5.08,16.51 J1.3 5.08,22.23 3.81,20.95 1.27,20.95 0.64,21.59 0.64,26.67 2.54,28.57 4.45,28.57 6.35,30.48 6.35,34.29 v6.99,34.92
SS  (via drill 0.51)
  Top 0.203: U$1.13 13.34,20.95 v13.97,21.59 | v13.34,29.84 13.34,33.66 13.97,34.29 JP15.1
  Bottom 0.203: v13.97,21.59 13.97,29.21 v13.34,29.84
VCC  (via drill 0.51)
  Top 0.203: 77.47,17.78 72.39,17.78 69.85,15.24 67.31,15.24 66.67,15.88 66.67,17.13 R6.2 66.66,17.16 66.04,17.78 59.69,17.78 57.15,15.24 54.61,15.24 53.98,15.88 53.98,17.13 R4.2 53.96,17.16 53.34,17.78 46.99,17.78 44.45,15.24 41.91,15.24 41.26,15.89 R2.2 40.01,15.89 40.01,14.61 39.37,13.97 v39.37,12.7 | 77.47,17.78 78.74,17.78 79.36,17.16 R8.2 79.38,17.13 79.38,15.88 80.01,15.24 82.55,15.24 85.09,17.78 91.44,17.78 92.06,17.16 R10.2 92.08,17.13 92.08,15.88 92.71,15.24 95.25,15.24 97.79,17.78 104.14,17.78 104.76,17.16 R12.2 104.78,17.13 104.78,15.88 105.41,15.24 107.95,15.24 110.49,17.78 116.84,17.78 117.46,17.16 R14.2 117.47,17.13 117.47,15.88 118.11,15.24 120.65,15.24 123.19,17.78 129.54,17.78 130.16,17.16 R16.2 130.16,15.89 130.81,15.24 134.34,15.24 134.48,15.38 | 2.08,18.61 R1.2 | 2.08,18.61 U$1.20 | 4.45,28.92 X1.VBUS | 4.45,28.92 4.45,27.3 J1.2 0.64,23.5 0.64,20.05 0.82,19.87 | 4.45,28.92 6,30.48 v9.53,30.48 | v17.14,33.02 17.78,32.38 ULN1.10 | 134.48,15.38 138.43,19.34 138.43,26.67 139.76,28 139.76,31.71 139.72,31.75 J2.GND | 0.82,19.87 2.08,18.61 | C3.1 0.82,9.01 | 0.82,9.01 0.82,19.87 | 77.47,17.78 JP15.5 | v2.54,8.89 2.42,9.01 0.82,9.01 | JP14.1 143.37,15.38 134.48,15.38
  Bottom 0.203: v9.53,30.48 9.53,32.38 10.16,33.02 v17.14,33.02 | J2.GNDBREAK 140.54,31.67 J2.GND | v39.37,12.7 38.1,11.43 35.56,11.43 34.29,10.16 25.4,10.16 20.32,5.08 12.06,5.08 11.43,5.71 11.43,6.35 10.79,6.99 3.81,6.99 2.54,8.26 v2.54,8.89

### Text on the board
tPlace: 1 | 2 | 3 | 4 | 5 | 6 | 7 | 8 | USB AC Controller | Evan Green | SS | SCK | MOSI | MISO | VCC | GND | +5V | GND | 1 | +5V | IN1-4 | IN5-8 | 1 | 2 | 3 | 4 | 5 | 6 | 7 | 8
bPlace: v1 4/2011